# EAGLE design pcb_pf (EAGLE 9.6.2)
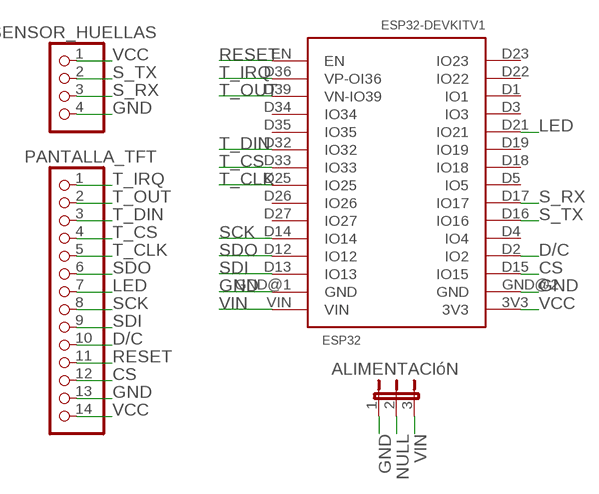
[diagram p0: schematic, sheet 1]

## Parts
ALIMENTACIóN  JP2E  [JP2]
ESP32  ESP32DEVKITV1  [ESP32-DEVKITV1]
PANTALLA_TFT  PINHD-1X14  [1X14]
SENSOR_HUELLAS  PINHD-1X4  [1X04]

## Nets
CS: ESP32.D15(IO15) PANTALLA_TFT.12
D/C: ESP32.D2(IO2) PANTALLA_TFT.10
GND: ALIMENTACIóN.1 ESP32.GND@1(GND) ESP32.GND@2(GND) PANTALLA_TFT.13 SENSOR_HUELLAS.4
LED: ESP32.D21(IO21) PANTALLA_TFT.7
NULL: ALIMENTACIóN.2
RESET: ESP32.EN PANTALLA_TFT.11
S_RX: ESP32.D17(IO17) SENSOR_HUELLAS.3
S_TX: ESP32.D16(IO16) SENSOR_HUELLAS.2
SCK: ESP32.D14(IO14) PANTALLA_TFT.8
SDI: ESP32.D13(IO13) PANTALLA_TFT.9
SDO: ESP32.D12(IO12) PANTALLA_TFT.6
T_CLK: ESP32.D25(IO25) PANTALLA_TFT.5
T_CS: ESP32.D33(IO33) PANTALLA_TFT.4
T_DIN: ESP32.D32(IO32) PANTALLA_TFT.3
T_IRQ: ESP32.D36(VP-OI36) PANTALLA_TFT.1
T_OUT: ESP32.D39(VN-IO39) PANTALLA_TFT.2
VCC: ESP32.3V3 PANTALLA_TFT.14 SENSOR_HUELLAS.1
VIN: ALIMENTACIóN.3 ESP32.VIN
Unconnected: ESP32.D1(IO1) ESP32.D3(IO3) ESP32.D4(IO4) ESP32.D5(IO5) ESP32.D18(IO18) ESP32.D19(IO19) ESP32.D22(IO22) ESP32.D23(IO23) ESP32.D26(IO26) ESP32.D27(IO27) ESP32.D34(IO34) ESP32.D35(IO35)

## Library data of the parts
ALIMENTACIóN = jumper:JP2E: JUMPER
ESP32 = ESP32-DEVKITV1:ESP32DEVKITV1
PANTALLA_TFT = pinhead:PINHD-1X14: PIN HEADER
SENSOR_HUELLAS = pinhead:PINHD-1X4: PIN HEADER

## Board
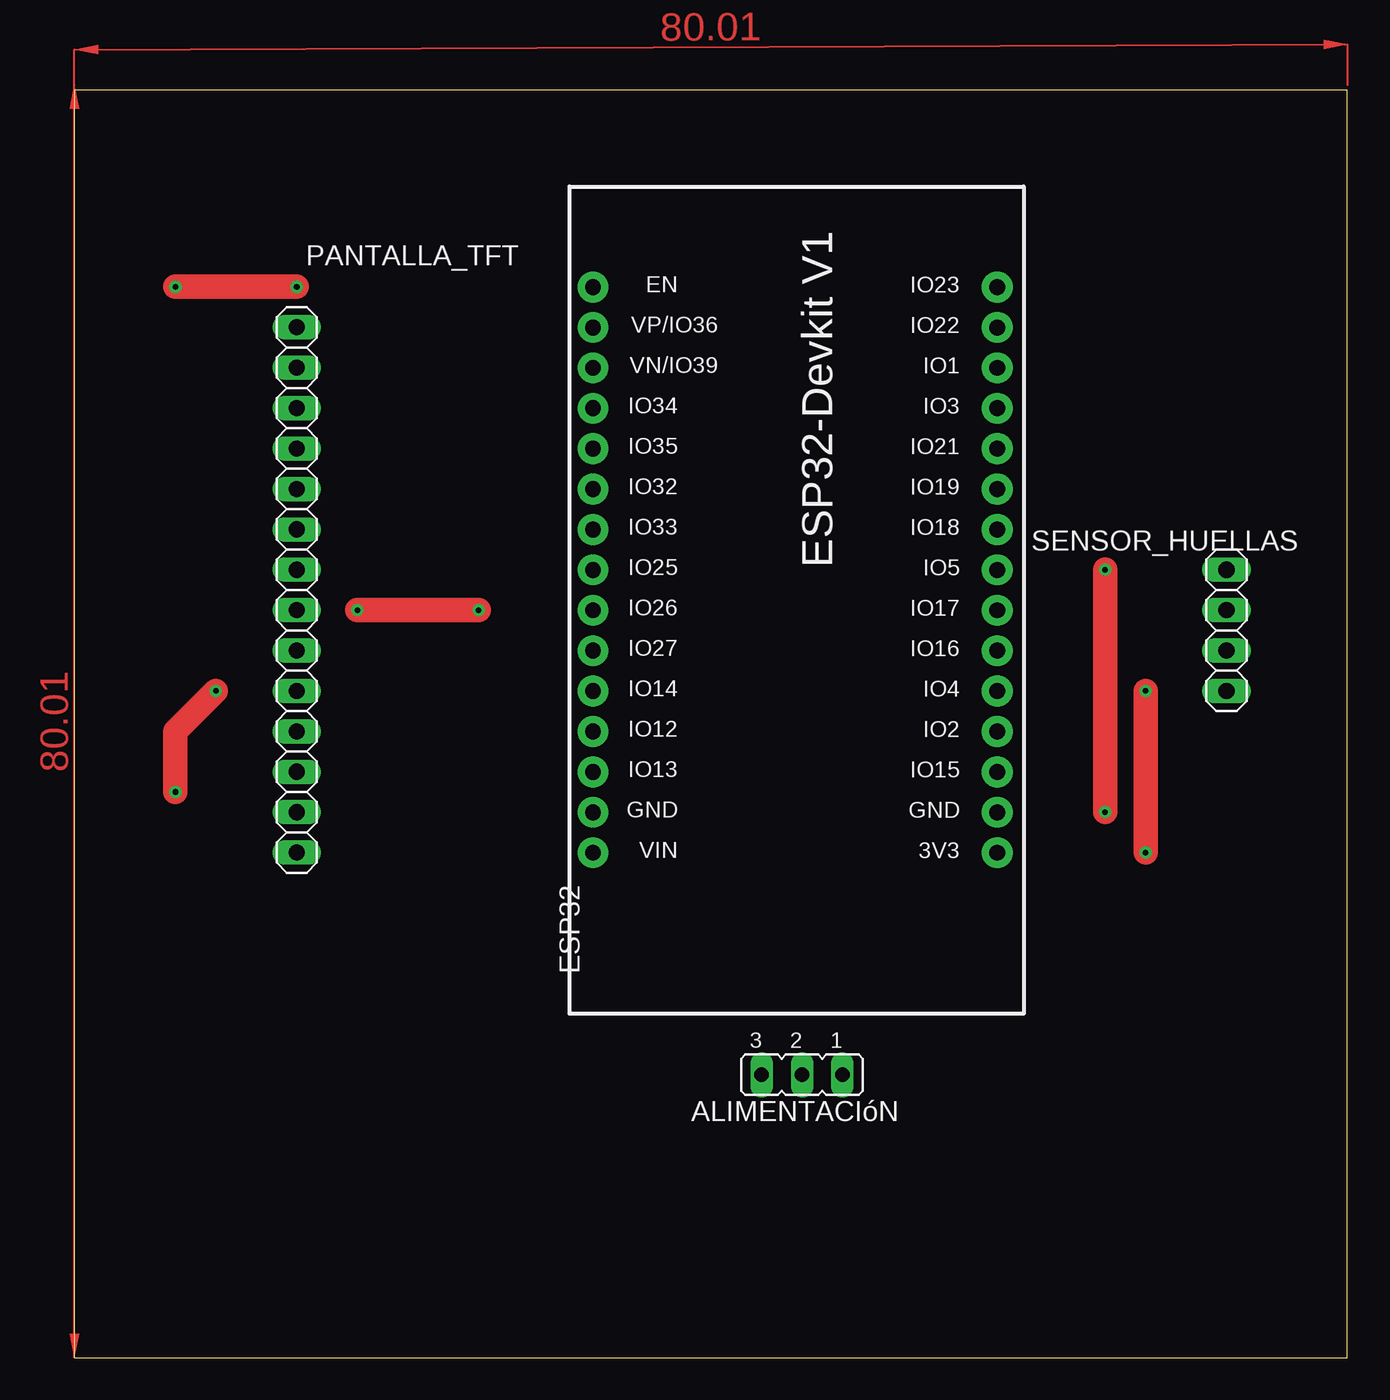
[diagram p1: board, top side]
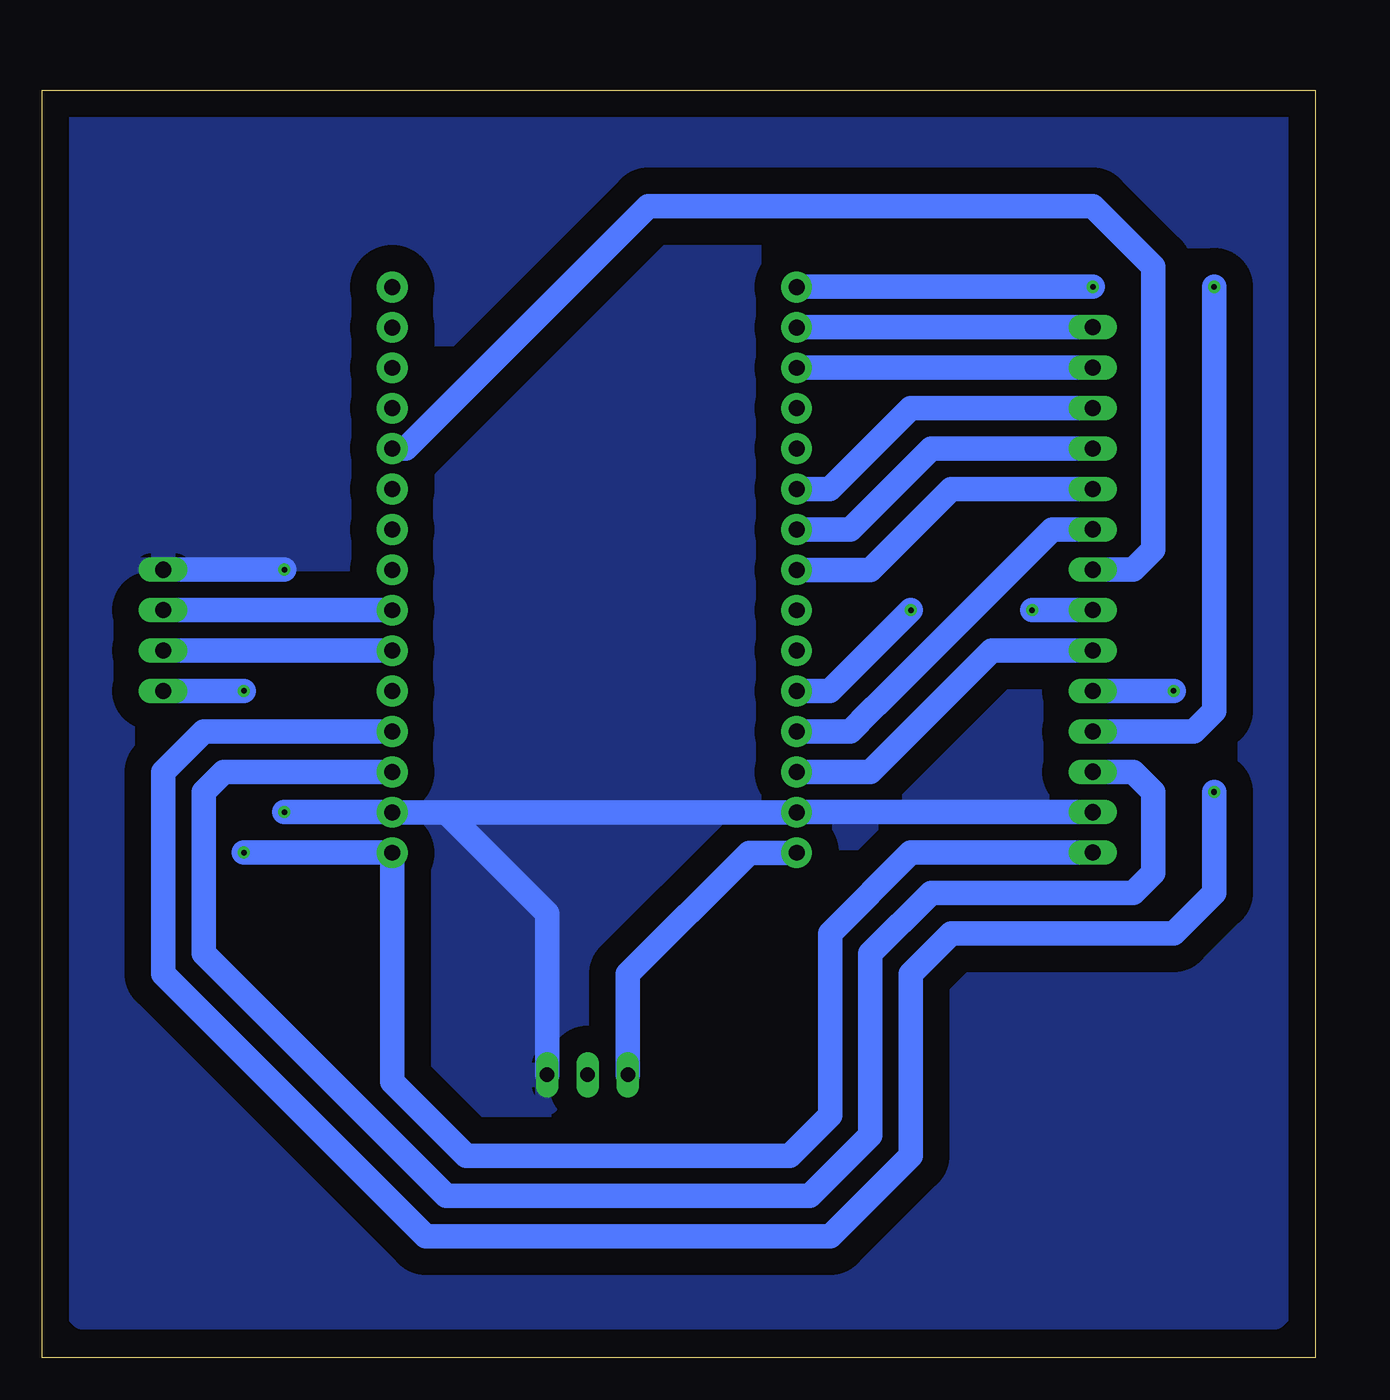
[diagram p2: board, bottom side, seen from below]

Size 79.99 x 79.68 mm. Coordinates in mm from the lower left corner, seen from the top.
Outline: 0,0 79.99,0 79.99,79.68 0,79.68 0,0
Copper layers (1*16): Top 0.035mm / dielectric 1.5mm / Bottom 0.035mm
Design rules "default": minimum track width 6mil, minimum drill 0.35mm, track to track 6mil, track to pad 6mil, pad to pad 6mil, via to via 6mil, smd to smd 6mil, copper to edge 40mil, drill to drill 6mil, minimum pad ring 10mil, minimum via ring 8mil, stop-mask expansion 4mil, vias tented up to drill 0mil, thermal gap 10mil

### Footprints (pad centres in the part's own frame; a part is rotated, then mirrored left to right if it is on the bottom)
JP2 = drill 0.914 long: 1 -2.54,0; 2 0,0; 3 2.54,0
ESP32-DEVKITV1 = drill 1 pad 1.93: 3V3 -16.52,-12.27; D1 13.96,-12.27; D2 -8.9,-12.27; D3 11.42,-12.27; D4 -6.36,-12.27; D5 1.26,-12.27; D12 -8.9,13.135; D13 -11.44,13.135; D14 -6.36,13.135; D15 -11.44,-12.27; D16 -3.82,-12.27; D17 -1.28,-12.27; D18 3.8,-12.27; D19 6.34,-12.27; D21 8.88,-12.27; D22 16.5,-12.27; D23 19.04,-12.27; D25 1.26,13.135; D26 -1.28,13.135; D27 -3.82,13.135; D32 6.34,13.135; D33 3.8,13.135; D34 11.42,13.135; D35 8.88,13.135; D36 16.5,13.135; D39 13.96,13.135; EN 19.04,13.135; GND@1 -13.98,13.135; GND@2 -13.98,-12.27; VIN -16.52,13.135
1X14 = drill 1.016 long: 1 -16.51,0; 2 -13.97,0; 3 -11.43,0; 4 -8.89,0; 5 -6.35,0; 6 -3.81,0; 7 -1.27,0; 8 1.27,0; 9 3.81,0; 10 6.35,0; 11 8.89,0; 12 11.43,0; 13 13.97,0; 14 16.51,0
1X04 = drill 1.016 long: 1 -3.81,0; 2 -1.27,0; 3 1.27,0; 4 3.81,0

### Placement (x,y rotation side)
ALIMENTACIóN  45.72,17.78 180 top
ESP32  45.72,48.26 90 top
PANTALLA_TFT  13.97,48.26 270 top
SENSOR_HUELLAS  72.39,45.72 90 top

### Tracks (layer width: path | path; a pad name or v marks a point on that pad's centre or on a via)
CS
  Bottom 1.524: PANTALLA_TFT.12 11.43,36.83 10.16,35.56 10.16,30.48 11.43,29.21 24.13,29.21 27.94,25.4 27.94,13.97 31.75,10.16 54.61,10.16 69.85,25.4 69.85,35.56 68.58,36.83 ESP32.D15
D/C  (via drill 0.35)
  Top 1.524: v8.89,41.91 6.35,39.37 v6.35,35.56
  Bottom 1.524: PANTALLA_TFT.10 v8.89,41.91 | v6.35,35.56 6.35,29.21 8.89,26.67 22.86,26.67 25.4,24.13 25.4,12.7 30.48,7.62 55.88,7.62 72.39,24.13 72.39,36.83 69.85,39.37 ESP32.D2
GND  (via drill 0.35)
  Top 1.524: v64.77,34.29 v64.77,49.53
  Bottom 1.524: v64.77,49.53 SENSOR_HUELLAS.4 | PANTALLA_TFT.13 ESP32.GND@1 54.61,34.28 | 54.61,34.28 ESP32.GND@2 v64.77,34.29 | ALIMENTACIóN.1 48.26,27.93 54.61,34.28
  pour Bottom (isolate 1.676): 2.54,78.74 77.47,78.74 78.74,77.47 78.74,3.81 77.47,2.54 2.54,2.54 1.27,3.81 1.27,77.47
LED
  Bottom 1.524: ESP32.D21 57.15,57.15 41.91,72.39 24.13,72.39 | 24.13,72.39 21.59,72.39 17.78,72.39 13.97,72.39 10.16,68.58 10.16,50.8 11.43,49.53 PANTALLA_TFT.7 | 24.13,72.39
RESET  (via drill 0.35)
  Top 1.524: v6.35,67.31 v13.97,67.31
  Bottom 1.524: ESP32.EN v13.97,67.31 | PANTALLA_TFT.11 7.62,39.37 6.35,40.64 v6.35,67.31
S_RX
  Bottom 1.524: ESP32.D17 SENSOR_HUELLAS.3
S_TX
  Bottom 1.524: ESP32.D16 SENSOR_HUELLAS.2
SCK  (via drill 0.35)
  Top 1.524: v17.78,46.99 v25.4,46.99
  Bottom 1.524: PANTALLA_TFT.8 v17.78,46.99 | ESP32.D14 30.49,41.9 v25.4,46.99
SDI
  Bottom 1.524: ESP32.D13 27.95,36.82 20.32,44.45 PANTALLA_TFT.9
SDO
  Bottom 1.524: PANTALLA_TFT.6 16.51,52.07 27.3,41.28 27.94,40.64 29.22,39.36 ESP32.D12
T_CLK
  Bottom 1.524: 32.57,49.53 ESP32.D25 27.95,49.52 22.86,54.61 PANTALLA_TFT.5
T_CS
  Bottom 1.524: PANTALLA_TFT.4 24.13,57.15 29.22,52.06 ESP32.D33 32.57,52.07
T_DIN
  Bottom 1.524: ESP32.D32 30.49,54.6 25.4,59.69 PANTALLA_TFT.3
T_IRQ
  Bottom 1.524: PANTALLA_TFT.1 ESP32.D36
T_OUT
  Bottom 1.524: PANTALLA_TFT.2 ESP32.D39
VCC  (via drill 0.35)
  Top 1.524: v67.31,41.91 v67.31,31.75
  Bottom 1.524: PANTALLA_TFT.14 25.4,31.75 30.48,26.67 30.48,15.24 33.02,12.7 53.34,12.7 57.99,17.35 ESP32.3V3 v67.31,31.75 | SENSOR_HUELLAS.1 v67.31,41.91
VIN
  Bottom 1.524: ALIMENTACIóN.3 43.18,24.13 35.57,31.74 ESP32.VIN
(copper drawn outside any net)
  shapes: Top area x2